# Altium schematic sheet Precharge_Discharge.SchDoc
size A
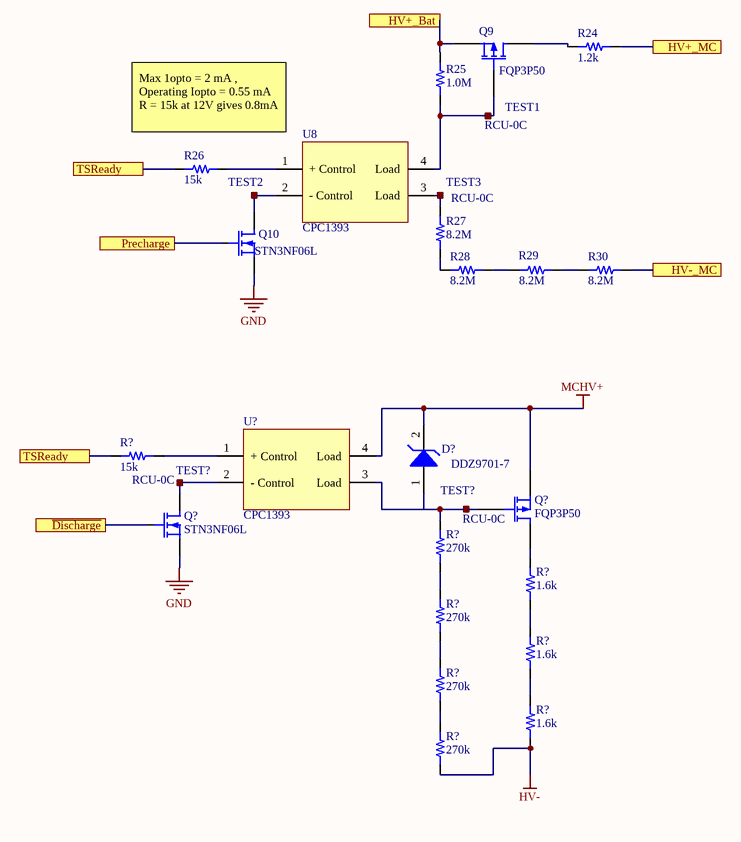
[diagram p0: Precharge_Discharge.SchDoc]

## Parts
(Parts that share a designator on the sheet are numbered #1, #2 ... from top to bottom, then left to right.)
D?  DDZ9701-7  [SOD123F]
Q9  FQP3P50  [TO-220AB]
Q10  STN3NF06L  [STN3NF06L]
Q?#1  FQP3P50  [TO-220AB]
Q?#2  STN3NF06L  [STN3NF06L]
R24  value 1.2k  [AP101]  (hidden comment: Resistor 1k2 100W 1% Throughhole)
R25  value 1.0M  [RES 0603/1608]  (hidden comment: Resistor 1.0M 0603 1/10W 10%)
R26  value 15k  [RES 0603/1608]  (hidden comment: Resistor 3.0k 0603 1/10W 1%)
R27  value 8.2M  [RES 0805/2012]  (hidden comment: Resistor 8.2M 0805 1/4W 5%)
R28  value 8.2M  [RES 0805/2012]  (hidden comment: Resistor 8.2M 0805 1/4W 5%)
R29  value 8.2M  [RES 0805/2012]  (hidden comment: Resistor 8.2M 0805 1/4W 5%)
R30  value 8.2M  [RES 0805/2012]  (hidden comment: Resistor 8.2M 0805 1/4W 5%)
R?#1  value 15k  [RES 0603/1608]  (hidden comment: Resistor 3.0k 0603 1/10W 1%)
R?#2  value 270k  [RES 0805/2012]  (hidden comment: Resistor 270k 0805 1/4W 5%)
R?#3  value 1.6k  [Axial 52mm Pitch]  (hidden comment: Resistor 1.6k Axial 10W 5%)
R?#4  value 270k  [RES 0805/2012]  (hidden comment: Resistor 270k 0805 1/4W 5%)
R?#5  value 1.6k  [Axial 52mm Pitch]  (hidden comment: Resistor 1.6k Axial 10W 5%)
R?#6  value 270k  [RES 0805/2012]  (hidden comment: Resistor 270k 0805 1/4W 5%)
R?#7  value 1.6k  [Axial 52mm Pitch]  (hidden comment: Resistor 1.6k Axial 10W 5%)
R?#8  value 270k  [RES 0805/2012]  (hidden comment: Resistor 270k 0805 1/4W 5%)
TEST1  RCU-0C  [RCU-0C]
TEST2  (no value)  [RCU-0C]
TEST3  RCU-0C  [RCU-0C]
TEST?#1  RCU-0C  [RCU-0C]
TEST?#2  RCU-0C  [RCU-0C]
U8  CPC1393  [CPC1393GR]
U?  CPC1393  [CPC1393GR]

## Ports
HV+_Bat, HV+_MC, HV-_MC, Precharge, TSReady, ~{Discharge}

## Nets
GND: Q10.3(S) Q?#2.3(S)
HV-: R?#7.1 R?#8.1
MCHV+: D?.2(K) Q?#1.3(S) U?.4(Load)
~{Discharge}: Q?#2.1(G) ; port ~{Discharge}
HV+_Bat: Q9.3(S) R25.1 ; port HV+_Bat
HV+_MC: R24.2 ; port HV+_MC
HV-_MC: R30.1 ; port HV-_MC
Precharge: Q10.1(G) ; port Precharge
TSReady: R26.1 R?#1.1 ; port TSReady
NetD?_1: D?.1(A) Q?#1.1(G) R?#2.2 TEST?#2.1 U?.3(Load)
NetQ9_1: Q9.1(G) R25.2 TEST1.1 U8.4(Load)
NetQ9_2: Q9.2(D) R24.1
NetQ10_2: Q10.2(D) TEST2.1 U8.2(-_Control)
NetQ?#1_2: Q?#1.2(D) R?#3.2
NetQ?#2_2: Q?#2.2(D) TEST?#1.1 U?.2(-_Control)
NetR26_2: R26.2 U8.1(+_Control)
NetR27_1: R27.1 R28.2
NetR27_2: R27.2 TEST3.1 U8.3(Load)
NetR28_1: R28.1 R29.2
NetR29_1: R29.1 R30.2
NetR?#1_2: R?#1.2 U?.1(+_Control)
NetR?#2_1: R?#2.1 R?#4.2
NetR?#3_1: R?#3.1 R?#5.2
NetR?#4_1: R?#4.1 R?#6.2
NetR?#5_1: R?#5.1 R?#7.2
NetR?#6_1: R?#6.1 R?#8.2

## Notes on the sheet
- Max 1opto = 2 mA ,          Operating Iopto = 0.55 mA
  R = 15k at 12V gives 0.8mA

## Library data of the parts
D? = 10: Zener Diode 14V 500mW ±5% Surface Mount SOD-123; Manufacturer_id: 8; idDiode: 10; Drawer_id: 1; Value: 14Vz; MfrPartNo: DDZ9701-7; Name: DDZ9701; Type: Zener; Num_Circuits: 1; Power: 500mW; Package: SOD-123; Link: https://www.digikey.com/product-detail/en/diodes-incorporated/DDZ9701-7/DDZ9701-7DICT-ND/3877402; ComponentLink1Description: Datasheet; ComponentLink1URL: https://www.diodes.com/assets/Datasheets/ds30410.pdf; Supplier1: Digi-Key; Supplier1PartNo: DDZ9701-7DICT-ND
Q9 Q?#1 = 5: Manufacturer_id: 1; idFETs: 5; Value: P_Channel; Vdss: 500V; Id: 2.7A; Rds_On: 4Ohms; Vgs(typ): 4.0v; Vgs(Max): 5.0V; Power(Max): 85W; Created_By: Angel; Drawer_id: 1; Name: FQP3P50; Num_Circuits: 1; Package: TO-220; MfrPartNo: FQP3P50; Link: https://www.digikey.com/product-detail/en/on-semiconductor/FQP3P50/FQP3P50-ND/1055021; Supplier1: Digi-Key; Supplier1PartNo: FQP3P50-ND
Q10 Q?#2 = 8: MOSFET N-CH 60V 4A SOT223; Manufacturer_id: 1; idFETs: 8; Value: N_Channel; Rds_On: 70m; Vgs(Max): +/- 16V; Power(Max): 3.3W; Created_By: Graydon; Drawer_id: 1; Name: STN3NF06L; Vdss: 60V; Num_Circuits: 1; Id: 4A; Package: SOT-233; MfrPartNo: STN3NF06L; Link: https://www.digikey.com/product-detail/en/stmicroelectronics/STN3NF06L/497-3177-1-ND/654516; ComponentLink1Description: Datasheet; ComponentLink1URL: https://www.st.com/content/ccc/resource/technical/document/datasheet/b1/52/93/f0/a9/a9/40/d7/CD00002430.pdf/files/CD00002430.pdf/jcr:content/translations/en.CD00002430.pdf; Supplier1: Digkey; Supplier1PartNo: 497-3177-1-ND; Created_Date: 11/26/2018
R24 = 2705: 100W Throughhole Resistor; Manufacturer_id: 1; idResistor: 2705; Name: AP101 1K2 J; Tolerance: 5%; Created_By: Graydon; Supplier 1: Digi-Key; Supplier Part Number 1: AP1011K2J-ND; Drawer_id: 1; Power: 100W; Package: TO-247-2; MfrPartNo: AP101 1K2 J; Link: https://www.digikey.com/short/jvdcjz; ComponentLink1Description: Datasheet; ComponentLink1URL: https://www.ohmite.com/assets/docs/acl_ap101.pdf?r=false; Created_Date: 2018-11-24
R25 = 2341: Manufacturer_id: 1; idResistor: 2341; Name: Res_1.0M_0603_1/10W_10%; Created_By: Nick Mah; Supplier 1: Digi-Key; Drawer_id: 1; Tolerance: 10%; Power: 1/10W; Package: 0603; ComponentLink1Description: Datasheet; Created_Date: 2018-10-20
R26 R?#1 = 300: Manufacturer_id: 1; idResistor: 300; Name: Res_3.0k_0603_1/10W_1%; Created_By: Nick Mah; Supplier 1: Digi-Key; Drawer_id: 1; Tolerance: 1%; Power: 1/10W; Package: 0603; ComponentLink1Description: Datasheet; Created_Date: 2018-10-20
R27-R30 = 1895: Manufacturer_id: 1; idResistor: 1895; Name: Res_8.2M_0805_1/4W_5%; Created_By: Nick Mah; Supplier 1: Digi-Key; Drawer_id: 1; Tolerance: 5%; Power: 1/4W; Package: 0805; ComponentLink1Description: Datasheet; Created_Date: 2018-10-20
R?#2 R?#4 R?#6 R?#8 = 1859: Manufacturer_id: 1; idResistor: 1859; Name: Res_270k_0805_1/4W_5%; Created_By: Nick Mah; Supplier 1: Digi-Key; Drawer_id: 1; Tolerance: 5%; Power: 1/4W; Package: 0805; ComponentLink1Description: Datasheet; Created_Date: 2018-10-20
R?#3 R?#5 R?#7 = 2706: Manufacturer_id: 1; MfrPartNo: SQP10AJB-1K6; idResistor: 2706; Name: Res_1.6k_Axial_10W_5%; Supplier 1: Digi-Key; Supplier Part Number 1: Digi-Key; Drawer_id: 1; Tolerance: 5%; Power: 10W; Package: Axial; Link: https://www.digikey.com/product-detail/en/yageo/SQP10AJB-1K6/1.6KW-10-ND/18787; ComponentLink1Description: Datasheet
TEST1-TEST3 TEST?#1 TEST?#2 = 14: Test point; Manufacturer_id: 1; idConn: 14; Value: CONN; Created_By: Graydon; Updated_By: Null; Drawer_id: 1; Name: RCU-0C; Num_Contacts: 1; Num_Rows: 1; Package: RCU-0C; MfrPartNo: RCU-0C; Link: https://www.digikey.com/product-detail/en/te-connectivity-amp-connectors/RCU-0C/A106145CT-ND/3477802; ComponentLink1Description: Null; ComponentLink1URL: Null; Supplier1: None; Supplier1PartNo: None; Created_Date: 11/10/2018
U8 U? = 26: Solid State Relay SPST-NO (1 Form A) 4-SMD (0.300", 7.62mm); Manufacturer_id: 1; MfrPartNo: CPC1393GRTR; idIC_Misc: 26; Value: Null; Created_By: Lynette; Drawer_id: 1; Name: CPC1393; Type: Null; Protocol: Null; Num_Circuits: 1; Data_Rate: Null; Vin(Min): Null; Vin(Max): Null; Package: CPC1393GR; Link: https://www.digikey.com/product-detail/en/ixys-integrated-circuits-division/CPC1393GRTR/CLA270CT-ND/1277144; ComponentLink1Description: Null; ComponentLink1URL: Null; Supplier1: Null; Supplier1PartNo: Null; Updated_By: Null